# Altium project Driver_MOSFET_DC_Input.PrjPcb
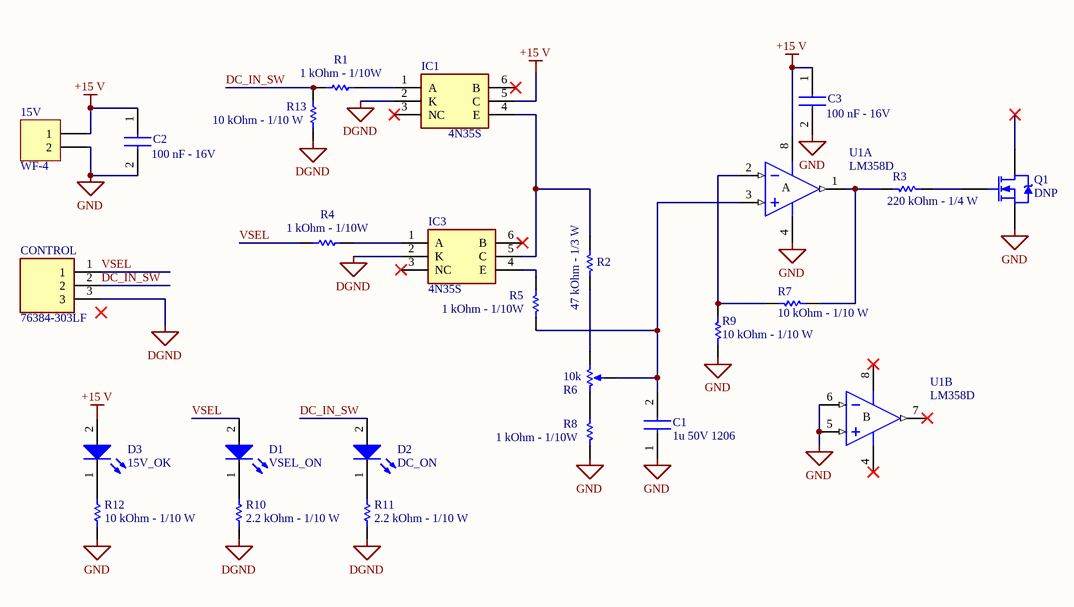
[diagram p0: Driver_MOSFET_DC_Input.SchDoc]
REV: R3
1 sheet, 25 parts. Net scope: global (net labels, ports and power ports of the same name join across sheets).
Board file: Driver_MOSFET_DC_Input.PcbDoc

## Sheet Driver_MOSFET_DC_Input.SchDoc: Driver MOSFET DC Input
size A4; CompanyName: TM; DrawnBy: Juan Tinazzo; Revision: R3; SheetNumber: 1; SheetTotal: 1; SPICEModelCacheHZCTWZKT: <root> / <DocumentId>HZCTWZKT</DocumentId> / <CacheFrame Number="0"> / <Model Name="lm358" Kind="CKT"> / <Text>*LM358 / *Dual LoPwr, HiGain, SnglSup OpAmp pkg:DIP8 (A:3,2,8,4,1)(B:5,6,8,4,7) / * / * Connections: / *              Non-Inverting Input / *              |   Inverting Input / *              |   |   Positive Power Supply / *              |   |   |   Negative Power Supply / *              |   |   |   |   Output / *              |   |   |   |   | / .SUBCKT LM358  1   2   3   4   5 / C1   11 12 5.544E-12 / C2    6  7 20.00E-12 / DC    5 53 DX / DE   54  5 DX / DLP  90 91 DX / DLN  92 90 DX / DP    4  3 DX / EGND 99  0 POLY(2) 3 0 4 0 0 .5 .5 / FB    7 99 POLY(5) VB VC VE VLP VLN 0 15.91E6 -20E6 20E6 20E6 -20E6 / GA    6  0 11 12 125.7E-6 / GCM   0  6 10 99 7.067E-9 / IEE   3 10 DC 10.04E-6 / HLIM 90  0 VLIM 1K / Q1   11  2 13 QX / Q2   12  1 14 QX / R2    6  9 100.0E3 / RC1   4 11 7.957E3 / RC2   4 12 7.957E3 / RE1  13 10 2.773E3 / RE2  14 10 2.773E3 / REE  10 99 19.92E6 / RO1   8  5 50 / RO2   7 99 50 / RP    3  4 30.31E3 / VB    9  0 DC 0 / VC 3 53 DC 2.100 / VE   54  4 DC .6 / VLIM  7  8 DC 0 / VLP  91  0 DC 40 / VLN   0 92 DC 40 / .MODEL DX D(IS=800.0E-18) / .MODEL QX PNP(IS=800.0E-18 BF=250) / .ENDS LM358</Text> / </Model> / </CacheFrame> / </root>; Number: 1

### Parts
15V  WF-4  [HDR1X2]  (no BOM)
C1  1u 50V 1206  [CAPC3216X180N]
C2  value 100 nF - 16V  [CAPC1608X95N]  (hidden comment: 100n)
C3  value 100 nF - 16V  [CAPC1608X95N]  (hidden comment: 100n)
CONTROL  76384-303LF  [76384303LF]
D1  VSEL_ON  [LEDC1608X80N]
D2  DC_ON  [LEDC1608X80N]
D3  15V_OK  [LEDC1608X80N]
IC1  4N35S  [4N35S]
IC3  4N35S  [4N35S]
Q1  DNP  [TO-247 Horiz. Heatsink]  (no BOM)
R1  value 1 kOhm - 1/10W  [RESC1608X55N]  (hidden comment: 1k)
R2  value 47 kOhm - 1/3 W  [RESC1608X55N]  (hidden comment: Res1)
R3  value 220 kOhm - 1/4 W  [RESC1608X55N]  (hidden comment: Res1)
R4  value 1 kOhm - 1/10W  [RESC1608X55N]  (hidden comment: 1k)
R5  value 1 kOhm - 1/10W  [RESC1608X55N]  (hidden comment: Res1)
R6  10k  [3296W-1]
R7  value 10 kOhm - 1/10 W  [RESC1608X55N]  (hidden comment: Res1)
R8  value 1 kOhm - 1/10W  [RESC1608X55N]  (hidden comment: Res1)
R9  value 10 kOhm - 1/10 W  [RESC1608X55N]  (hidden comment: Res1)
R10  value 2.2 kOhm - 1/10 W  [RESC1608X50N]  (hidden comment: CRCW06032K20FKEA)
R11  value 2.2 kOhm - 1/10 W  [RESC1608X50N]  (hidden comment: CRCW06032K20FKEA)
R12  value 10 kOhm - 1/10 W  [RESC1608X50N]  (hidden comment: CRCW060310K0FKEA)
R13  value 10 kOhm - 1/10 W  [RESC1608X50N]  (hidden comment: CRCW060310K0FKEA)
U1  LM358D  [751-07_M]  (parts A,B of 2)

### Nets
+15 V: 15V.1 C2.1 C3.1 D3.2(A) IC1.5(C) U1.8(V+)
DGND: CONTROL.3 IC1.2(K) IC3.2(K) R10.1 R11.1 R13.1
GND: 15V.2 C1.1 C2.2 C3.2 Q1.3(S) R8.2 R9.2 R12.1 U1.4(V-) U1.5(IN+) U1.6(IN-)
DC_IN_SW: CONTROL.2 D2.2(A) R1.1 R13.2
VSEL: CONTROL.1 D1.2(A) R4.1
NetC1_2: C1.2 R5.2 R6.2(BOT) U1.3(IN+)
NetD1_1: D1.1(K) R10.2
NetD2_1: D2.1(K) R11.2
NetD3_1: D3.1(K) R12.2
NetIC1_1: IC1.1(A) R1.2
NetIC1_4: IC1.4(E) IC3.5(C) R2.1
NetIC3_1: IC3.1(A) R4.2
NetIC3_4: IC3.4(E) R5.1
NetQ1_1: Q1.1(G) R3.2
NetR2_2: R2.2 R6.1(TOP)
NetR3_1: R3.1 R7.2 U1.1(OUT)
NetR6_3: R6.3(TAP) R8.1
NetR7_1: R7.1 R9.1 U1.2(IN-)

Not connected (* = marked no-connect by the designer): IC1 3(NC)* 6(B)*; IC3 3(NC)* 6(B)*; Q1 2(D)*; U1 7(OUT)*

### Notes on the sheet
- Title
- Size:
- Date:
- A4
- Number:
- Time:
- Revision:
- Sheet
- of
- Drawn by:
- Company:
- File:
- (in symbol LM358D, part A) A
- (in symbol LM358D, part B) B

### Library data of the parts
15V = MHDR1X2: Header, 2-Pin; Manufacturer_Part_Number: Header 2P; System: Connector; Value: DNP; LatestRevisionDate: 17-Jul-2002; LatestRevisionNote: Re-released for DXP Platform.; Publisher: Altium Limited
C1 = C3216X7R1H105K160AE: Capacitor; Manufacturer_Name: TDK; Value: 1 uF - 50V; Datasheet Link: https://product.tdk.com/info/en/catalog/datasheets/mlcc_commercial_midvoltage_en.pdf; Height: 1.8mm; Manufacturer_Part_Number: C3216X7R1H105K160AE; Mouser Part Number: 810-C3216X7R1H105KST; Mouser Price/Stock: https://www.mouser.co.uk/ProductDetail/TDK/C3216X7R1H105K160AE?qs=LcTL%2F5vFEzHWgMW0Em18fQ%3D%3D; Arrow Part Number: C3216X7R1H105K160AE; Arrow Price/Stock: https://www.arrow.com/en/products/c3216x7r1h105k160ae/tdk?region=nac
C2 C3 = EMK107B7104KA-T: Capacitor; Manufacturer_Name: TAIYO YUDEN; Datasheet Link: http://www.farnell.com/datasheets/746258.pdf; Height: 0.95mm; Manufacturer_Part_Number: EMK107B7104KA-T; Mouser Part Number: 963-EMK107B7104KA-T; Mouser Price/Stock: https://www.mouser.co.uk/ProductDetail/Taiyo-Yuden/EMK107B7104KA-T?qs=I6KAKw0tg2ybqzX8hKPgfw%3D%3D; Arrow Part Number: EMK107B7104KA-T; Arrow Price/Stock: https://www.arrow.com/en/products/emk107b7104ka-t/taiyo-yuden
CONTROL = 76384-303LF: Connector; Manufacturer_Name: Amphenol Communications Solutions; Value: Alojamientos de cables y cabecera 3P VERT; Datasheet Link: https://cdn.amphenol-cs.com/media/wysiwyg/files/drawing/76384.pdf; Height: 9.49mm; Manufacturer_Part_Number: 76384-303LF; Mouser Part Number: 649-76384-303LF; System: Connector
D1-D3 = 150060GS75000: LED; Manufacturer_Name: Wurth Elektronik; Value: LED Verde - 3,2V 20 mA; Datasheet Link: https://componentsearchengine.com/Datasheets/2/150060GS75000.pdf; Height: 0.8mm; Manufacturer_Part_Number: 150060GS75000; Mouser Part Number: 710-150060GS75000; Mouser Price/Stock: https://www.mouser.co.uk/ProductDetail/Wurth-Elektronik/150060GS75000?qs=LlUlMxKIyB0UYkq5lDO8nA%3D%3D
IC1 IC3 = 4N35S: Integrated Circuit; Manufacturer_Name: Lite-On; Value: Optoacopladores de salida de transistores PTR 100%, 3.5KV; Datasheet Link: http://optoelectronics.liteon.com/upload/download/DS-70-99-0012/4N3X%20Series%201115.pdf; Height: 4.6mm; Manufacturer_Part_Number: 4N35S
Q1 = IPx65R110CFD: Infineon Power MOSFET N-Channel 650V 31.2A; Published: 17-Sep-2003; DatasheetVersion: 13-Jul-2001; PackageVersion: 16-Sep-2002; PackageReference: SMD-0.5; Publisher: Altium Limited; PackageDescription: SM; 3 Leadless Terminals; Body 10.28 x 7.64 x 3.06 mm (LxWxH); ComponentLink1Description: Manufacturer Link; ComponentLink1URL: http://www.irf.com/; ComponentLink2Description: Datasheet; ComponentLink2URL: http://www.irf.com/product-info/datasheets/data/IRHN7150.pdf
R1 R4 = RMC16K102FTP: Resistor; Manufacturer_Name: Kamaya; Datasheet Link: https://www.mouser.jp/datasheet/2/210/kamaya_products_RMC__english_20170424_100617-1524908.pdf; Height: 0.55mm; Manufacturer_Part_Number: RMC16K102FTP
R2 = Res1: Resistor; Manufacturer_Name: Vishay; Manufacturer_Part_Number: CRCW060347K0FKEAHP; Published: 8-Jun-2000; LatestRevisionDate: 17-Jul-2002; LatestRevisionNote: Re-released for DXP Platform.; PackageReference: AXIAL-0.3; Publisher: Altium Limited; PackageDescription: Axial Device, Thru-Hole; 2 Leads; 0.3 in Pin Spacing
R3 = Res1: Resistor; Manufacturer_Name: Vishay; Manufacturer_Part_Number: CRCW1206220KFKEA; Published: 8-Jun-2000; LatestRevisionDate: 17-Jul-2002; LatestRevisionNote: Re-released for DXP Platform.; PackageReference: AXIAL-0.3; Publisher: Altium Limited; PackageDescription: Axial Device, Thru-Hole; 2 Leads; 0.3 in Pin Spacing
R5 R8 = Res1: Resistor; Manufacturer_Name: Kamaya; Manufacturer_Part_Number: RMC16K102FTP; Published: 8-Jun-2000; LatestRevisionDate: 17-Jul-2002; LatestRevisionNote: Re-released for DXP Platform.; PackageReference: AXIAL-0.3; Publisher: Altium Limited; PackageDescription: Axial Device, Thru-Hole; 2 Leads; 0.3 in Pin Spacing
R6 = 3296W-1-502LF: Resistor; Manufacturer_Name: Bourns; Value: 10k Ohm - 500 mW; Datasheet Link: https://componentsearchengine.com/Datasheets/2/3296W-1-502LF.pdf; Manufacturer_Part_Number: 3296W-1-502LF; Mouser Part Number: 652-3296W-1-502LF; Mouser Price/Stock: https://www.mouser.co.uk/ProductDetail/Bourns/3296W-1-502LF?qs=zl1BDXJPZVrTnesl5BcuCQ%3D%3D; Arrow Part Number: 3296W-1-502LF; Arrow Price/Stock: https://www.arrow.com/en/products/3296w-1-502lf/bourns?region=europe
R7 R9 = Res1: Resistor; Manufacturer_Name: Vishay; Manufacturer_Part_Number: CRCW060310K0FKEA; Published: 8-Jun-2000; LatestRevisionDate: 17-Jul-2002; LatestRevisionNote: Re-released for DXP Platform.; PackageReference: AXIAL-0.3; Publisher: Altium Limited; PackageDescription: Axial Device, Thru-Hole; 2 Leads; 0.3 in Pin Spacing
R10 R11 = CRCW06032K20FKEA: Resistor; Manufacturer_Name: Vishay; Datasheet Link: http://www.vishay.com/docs/20035/dcrcwe3.pdf; Height: 0.5mm; Manufacturer_Part_Number: CRCW06032K20FKEA; Mouser Part Number: 71-CRCW0603-2.2K-E3; Mouser Price/Stock: https://www.mouser.co.uk/ProductDetail/Vishay-Dale/CRCW06032K20FKEA?qs=wckIcdUuIXiMEbhHncbunA%3D%3D; Arrow Part Number: CRCW06032K20FKEA; Arrow Price/Stock: https://www.arrow.com/en/products/crcw06032k20fkea/vishay?region=nac
R12 R13 = CRCW060310K0FKEA: Resistor; Manufacturer_Name: Vishay; Datasheet Link: http://www.vishay.com/docs/20035/dcrcwe3.pdf; Height: 0.5mm; Manufacturer_Part_Number: CRCW060310K0FKEA; Mouser Part Number: 71-CRCW0603-10K-E3; Mouser Price/Stock: https://www.mouser.co.uk/ProductDetail/Vishay-Dale/CRCW060310K0FKEA?qs=pAO1Z172M84BVnhDjtnsoQ%3D%3D; Arrow Part Number: CRCW060310K0FKEA; Arrow Price/Stock: https://www.arrow.com/en/products/crcw060310k0fkea/vishay?region=nac
U1 = LM358D: Dual Operational Amplifier; Manufacturer_Name: Texas Instruments; Manufacturer_Part_Number: LM358AM/NOPB; Value: Amplificadores operacionales - Op Amps LOW PWR DUAL OP AMP; Published: 16-Jan-2001; LatestRevisionDate: 13-Apr-2006; LatestRevisionNote: IPC-7351 Footprint Added.; DatasheetVersion: Jul-1998; PackageVersion: Jan-1998; PackageReference: D008; Publisher: Altium Limited; PackageDescription: 8-Pin Small Outline Integrated Circuit 1.27 mm Pitch; Code_IPC: SOIC127P600-8; ComponentLink1Description: Manufacturer Link; ComponentLink1URL: http://www.ti.com/; ComponentLink2Description: Datasheet; ComponentLink2URL: http://www-s.ti.com/sc/ds/lm358.pdf